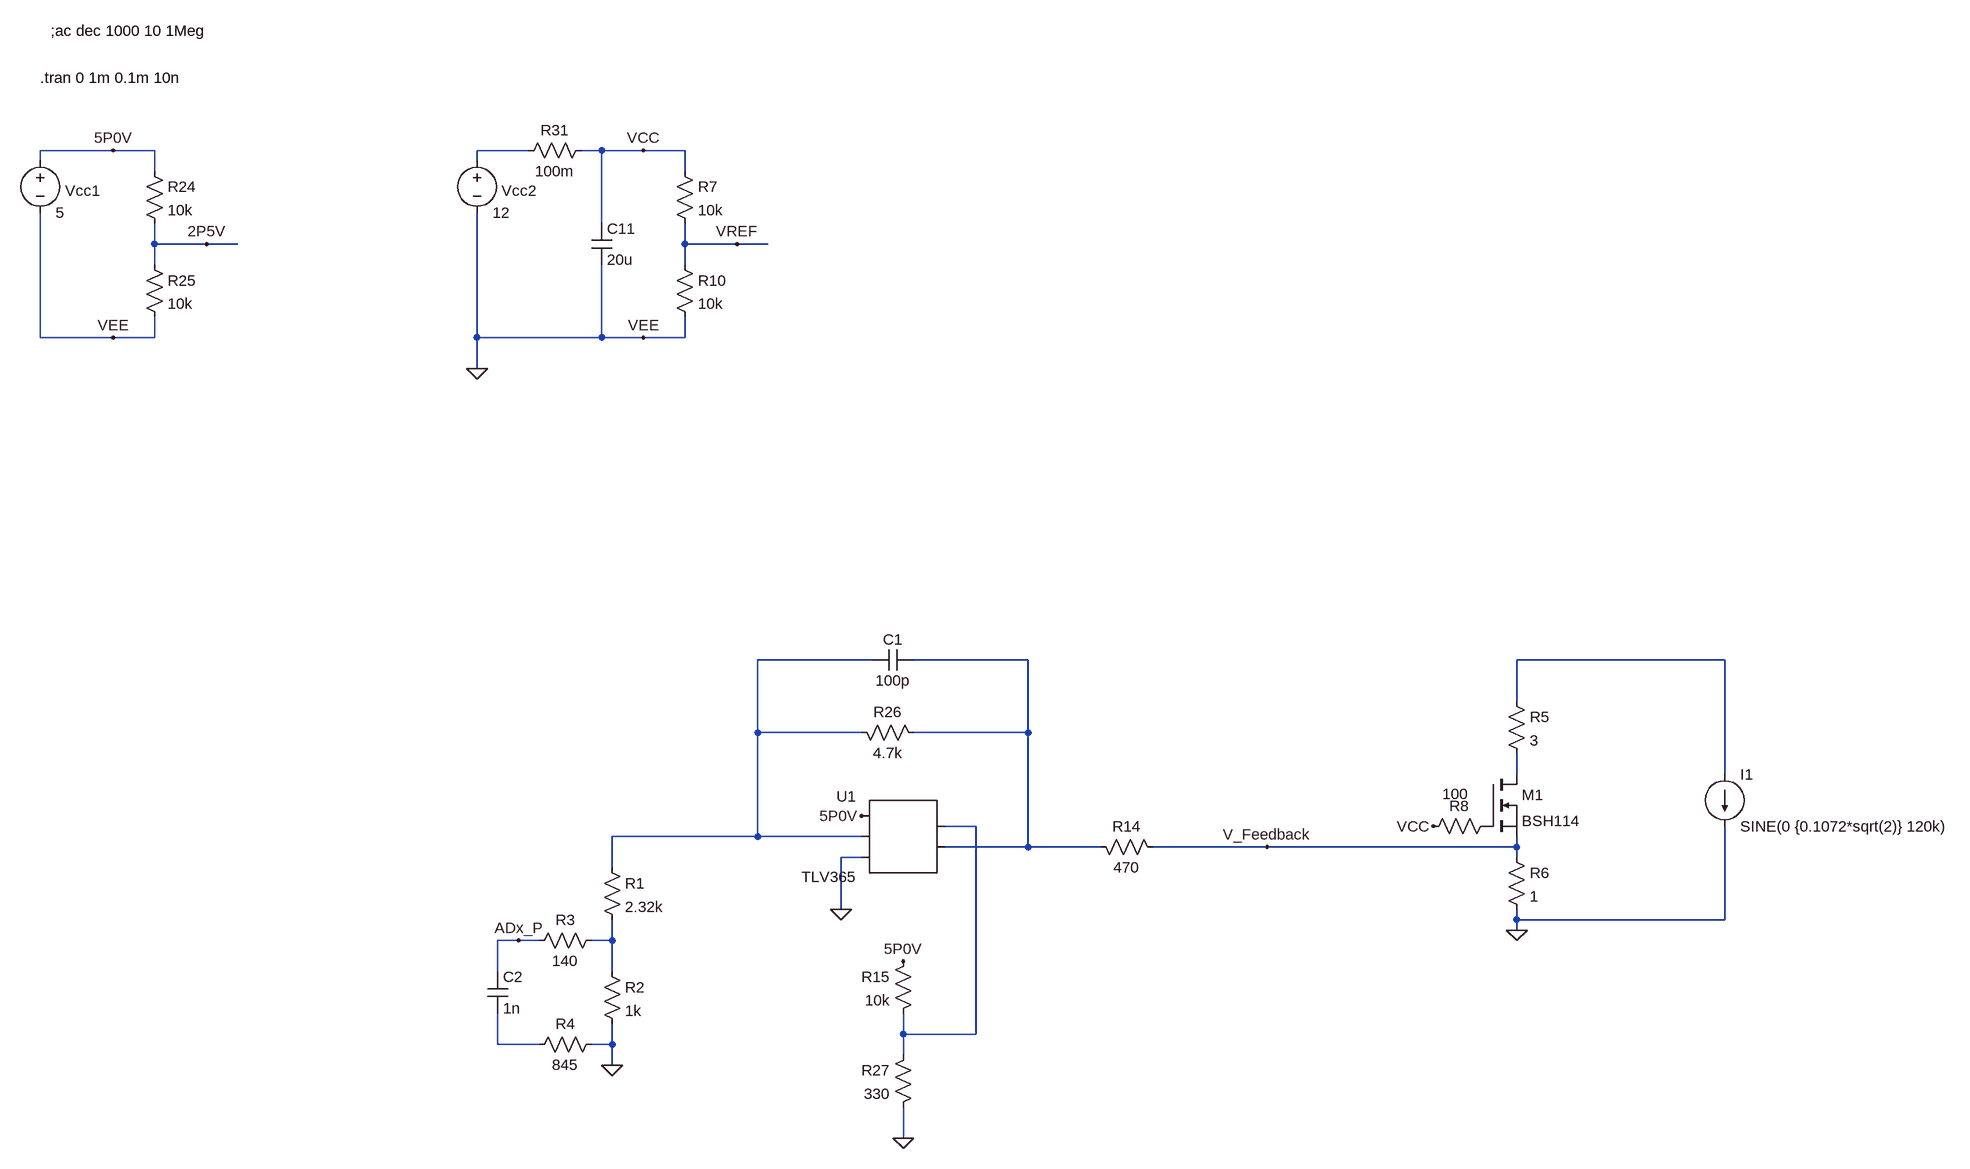
[diagram p0: schematic DIPS_Transmitter_MeasCircuit.asc]
DIPS_Transmitter_MeasCircuit.asc, the LTspice schematic file:
Version 4
SHEET 1 7284 15764
WIRE 1856 3712 1744 3712
WIRE 1920 3712 1856 3712
WIRE 2496 3712 2416 3712
WIRE 2608 3712 2576 3712
WIRE 2672 3712 2608 3712
WIRE 2736 3712 2672 3712
WIRE 1744 3728 1744 3712
WIRE 2416 3728 2416 3712
WIRE 1920 3744 1920 3712
WIRE 2736 3744 2736 3712
WIRE 2608 3824 2608 3712
WIRE 1920 3856 1920 3824
WIRE 2000 3856 1920 3856
WIRE 2048 3856 2000 3856
WIRE 2736 3856 2736 3824
WIRE 2816 3856 2736 3856
WIRE 2864 3856 2816 3856
WIRE 1920 3888 1920 3856
WIRE 2736 3888 2736 3856
WIRE 1744 4000 1744 3808
WIRE 1856 4000 1744 4000
WIRE 1920 4000 1920 3968
WIRE 1920 4000 1856 4000
WIRE 2416 4000 2416 3808
WIRE 2608 4000 2608 3888
WIRE 2608 4000 2416 4000
WIRE 2672 4000 2608 4000
WIRE 2736 4000 2736 3968
WIRE 2736 4000 2672 4000
WIRE 2416 4048 2416 4000
WIRE 3024 4496 2848 4496
WIRE 3264 4496 3088 4496
WIRE 4336 4496 4016 4496
WIRE 4016 4560 4016 4496
WIRE 2848 4608 2848 4496
WIRE 3008 4608 2848 4608
WIRE 3264 4608 3264 4496
WIRE 3264 4608 3088 4608
WIRE 4016 4672 4016 4640
WIRE 4336 4672 4336 4496
WIRE 3184 4752 3136 4752
WIRE 2848 4768 2848 4608
WIRE 2848 4768 2624 4768
WIRE 3008 4768 2848 4768
WIRE 3264 4784 3264 4608
WIRE 3264 4784 3136 4784
WIRE 3376 4784 3264 4784
WIRE 3632 4784 3456 4784
WIRE 4016 4784 4016 4768
WIRE 4016 4784 3632 4784
WIRE 3008 4800 2976 4800
WIRE 4016 4800 4016 4784
WIRE 2624 4816 2624 4768
WIRE 2976 4880 2976 4800
WIRE 4016 4896 4016 4880
WIRE 4336 4896 4336 4752
WIRE 4336 4896 4016 4896
WIRE 4016 4912 4016 4896
WIRE 2480 4928 2448 4928
WIRE 2512 4928 2480 4928
WIRE 2624 4928 2624 4896
WIRE 2624 4928 2592 4928
WIRE 2448 4976 2448 4928
WIRE 2624 4976 2624 4928
WIRE 3072 5072 3072 5040
WIRE 3184 5072 3184 4752
WIRE 3184 5072 3072 5072
WIRE 2448 5088 2448 5040
WIRE 2512 5088 2448 5088
WIRE 2624 5088 2624 5056
WIRE 2624 5088 2592 5088
WIRE 3072 5104 3072 5072
WIRE 2624 5120 2624 5088
WIRE 3072 5232 3072 5184
FLAG 2672 3712 VCC
FLAG 2672 4000 VEE
FLAG 2816 3856 VREF
FLAG 2416 4048 0
FLAG 4016 4912 0
FLAG 3888 4752 VCC
FLAG 1856 3712 5P0V
FLAG 1856 4000 VEE
FLAG 2000 3856 2P5V
FLAG 3008 4736 5P0V
FLAG 2976 4880 0
FLAG 3072 5232 0
FLAG 3072 4960 5P0V
FLAG 2624 5120 0
FLAG 2480 4928 ADx_P
FLAG 3632 4784 V_Feedback
SYMBOL voltage 2416 3712 R0
WINDOW 123 0 0 Left 2
WINDOW 0 38 62 Left 2
WINDOW 39 0 0 Left 0
SYMATTR InstName Vcc2
SYMATTR Value 12
SYMBOL res 2720 3728 R0
SYMATTR InstName R7
SYMATTR Value 10k
SYMBOL res 2720 3872 R0
SYMATTR InstName R10
SYMATTR Value 10k
SYMBOL res 4000 4544 R0
SYMATTR InstName R5
SYMATTR Value 3
SYMBOL res 4000 4784 R0
SYMATTR InstName R6
SYMATTR Value 1
SYMBOL nmos 3968 4672 R0
SYMATTR InstName M1
SYMATTR Value BSH114
SYMBOL res 3984 4736 R90
WINDOW 0 0 56 VBottom 2
WINDOW 3 -49 62 VTop 2
SYMATTR InstName R8
SYMATTR Value 100
SYMBOL voltage 1744 3712 R0
WINDOW 123 0 0 Left 2
WINDOW 0 38 62 Left 2
SYMATTR InstName Vcc1
SYMATTR Value 5
SYMBOL res 1904 3728 R0
SYMATTR InstName R24
SYMATTR Value 10k
SYMBOL res 1904 3872 R0
SYMATTR InstName R25
SYMATTR Value 10k
SYMBOL cap 2592 3824 R0
SYMATTR InstName C11
SYMATTR Value 20u
SYMATTR SpiceLine Rser=5m
SYMBOL res 2592 3696 R90
WINDOW 0 0 56 VBottom 2
WINDOW 3 32 56 VTop 2
SYMATTR InstName R31
SYMATTR Value 100m
SYMBOL res 3360 4768 M90
WINDOW 0 0 56 VBottom 2
WINDOW 3 32 56 VTop 2
SYMATTR InstName R14
SYMATTR Value 470
SYMBOL AutoGenerated\\TLV365 3072 4768 M0
SYMATTR InstName U1
SYMBOL res 3088 4944 M0
SYMATTR InstName R15
SYMATTR Value 10k
SYMBOL res 2992 4592 M90
WINDOW 0 0 56 VBottom 2
WINDOW 3 32 56 VTop 2
SYMATTR InstName R26
SYMATTR Value 4.7k
SYMBOL res 3088 5088 M0
SYMATTR InstName R27
SYMATTR Value 330
SYMBOL cap 3088 4480 R90
WINDOW 0 0 32 VBottom 2
WINDOW 3 32 32 VTop 2
SYMATTR InstName C1
SYMATTR Value 100p
SYMBOL current 4336 4672 R0
WINDOW 123 0 0 Left 0
WINDOW 39 0 0 Left 0
SYMATTR InstName I1
SYMATTR Value SINE(0 {0.1072*sqrt(2)} 120k)
SYMBOL res 2608 4800 R0
SYMATTR InstName R1
SYMATTR Value 2.32k
SYMBOL res 2608 4960 R0
SYMATTR InstName R2
SYMATTR Value 1k
SYMBOL res 2608 4912 R90
WINDOW 0 0 56 VBottom 2
WINDOW 3 32 56 VTop 2
SYMATTR InstName R3
SYMATTR Value 140
SYMBOL res 2608 5072 R90
WINDOW 0 0 56 VBottom 2
WINDOW 3 32 56 VTop 2
SYMATTR InstName R4
SYMATTR Value 845
SYMBOL cap 2432 4976 R0
SYMATTR InstName C2
SYMATTR Value 1n
TEXT 1744 3600 Left 2 !.tran 0 1m 0.1m 10n
TEXT 1760 3528 Left 2 !;ac dec 1000 10 1Meg

The netlist it stands for:
* DIPS_Transmitter_MeasCircuit.asc
Vcc2 N001 0 12
R7 VCC VREF 10k
R10 VREF 0 10k
R5 N004 N005 3
R6 V_Feedback 0 1
M1 N005 P001 V_Feedback V_Feedback BSH114
R8 P001 VCC 100
Vcc1 5P0V 0 5
R24 5P0V 2P5V 10k
R25 2P5V 0 10k
C11 VCC 0 20u Rser=5m
R31 VCC N001 100m
R14 N003 V_Feedback 470
* U1: TLV365 (symbol AutoGenerated\TLV365 not available, pins judged from their places): pin1=N006 pin2=N003 pin3=5P0V pin4=N002 pin5=0
R15 5P0V N006 10k
R26 N002 N003 4.7k
R27 N006 0 330
C1 N003 N002 100p
I1 N004 0 SINE(0 {0.1072*sqrt(2)} 120k)
R1 N002 N007 2.32k
R2 N007 0 1k
R3 N007 ADx_P 140
R4 0 N008 845
C2 ADx_P N008 1n
.model NMOS NMOS
.model PMOS PMOS
.lib standard.mos
.tran 0 1m 0.1m 10n
;ac dec 1000 10 1Meg
.backanno
.end